# Altium schematic sheet Con485.SchDoc
size A4
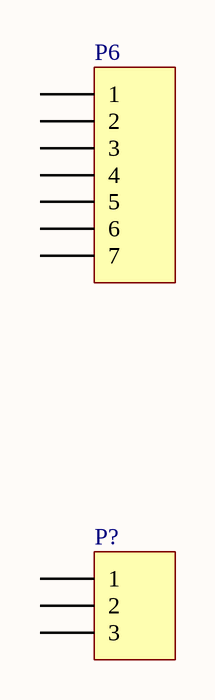
[diagram p0: Con485.SchDoc]

## Parts
P6  Header 7  [HDR1X7]  (value not drawn)
P?  Header 3  [HDR1X3]  (value not drawn)

## Nets

Not connected (* = marked no-connect by the designer): P6 1 2 3 4 5 6 7; P? 1 2 3

## Library data of the parts
P6 = Header 7: Header, 7-Pin; LatestRevisionDate: 17-Jul-2002; LatestRevisionNote: Re-released for DXP Platform.; Publisher: Altium Limited
P? = Header 3: Header, 3-Pin; LatestRevisionDate: 17-Jul-2002; LatestRevisionNote: Re-released for DXP Platform.; Publisher: Altium Limited